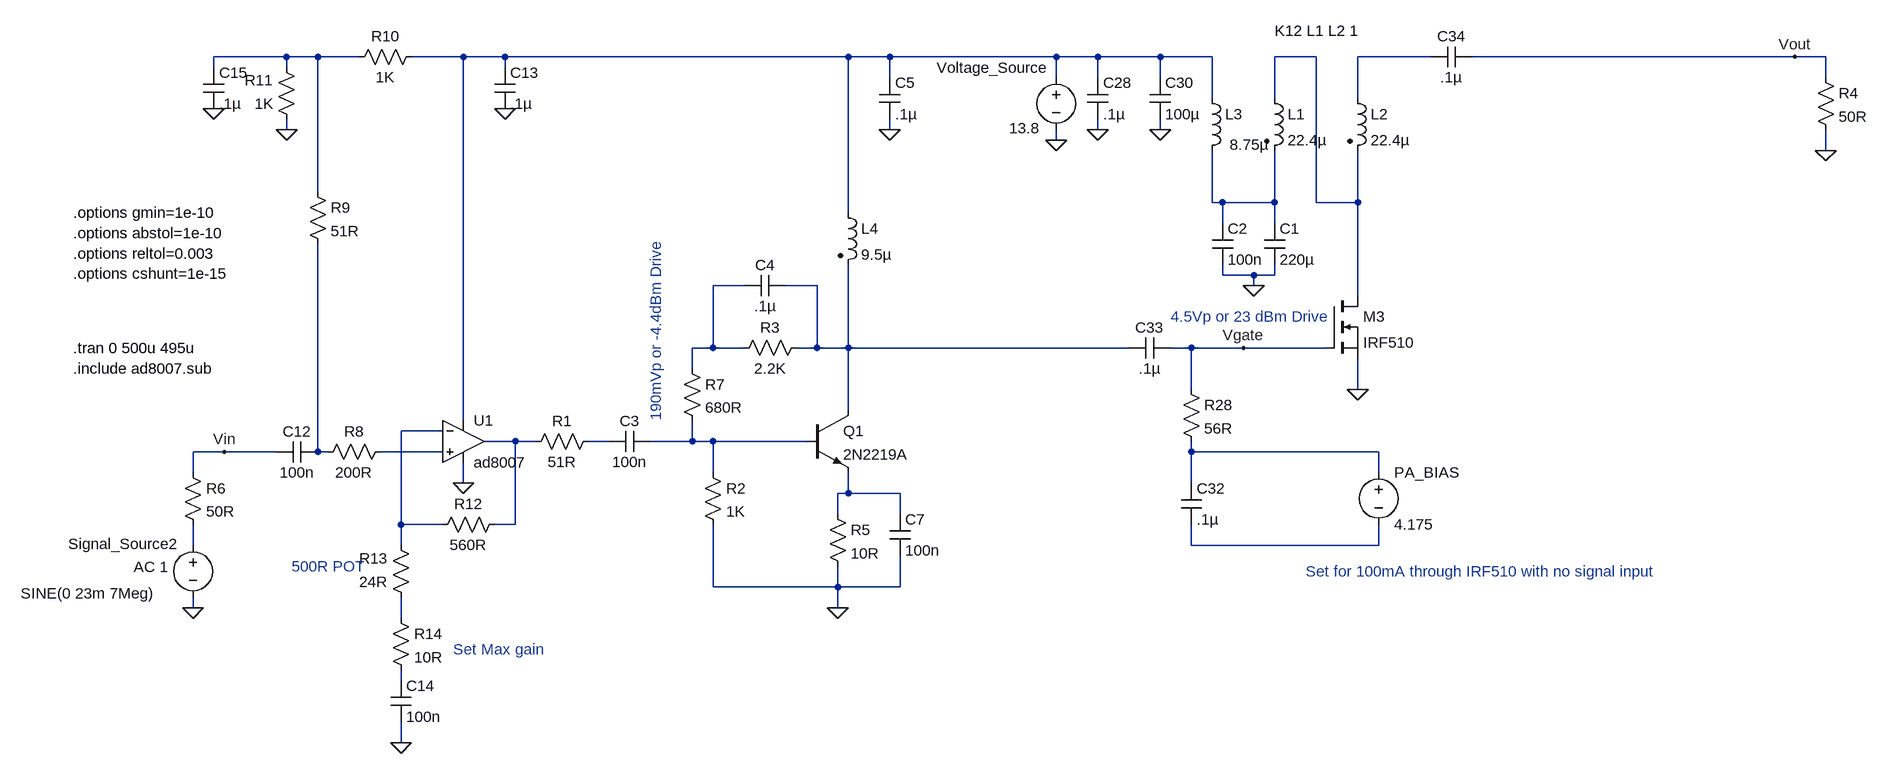
[diagram p0: schematic Power Amp PreDriver+Driver+IRF510 Stage.asc]
Power Amp PreDriver+Driver+IRF510 Stage.asc, the LTspice schematic file:
Version 4
SHEET 1 2716 3076
WIRE -736 1392 -848 1392
WIRE -688 1392 -736 1392
WIRE -624 1392 -688 1392
WIRE -464 1392 -544 1392
WIRE -400 1392 -464 1392
WIRE 128 1392 -400 1392
WIRE 192 1392 128 1392
WIRE 448 1392 192 1392
WIRE 512 1392 448 1392
WIRE 608 1392 512 1392
WIRE 688 1392 608 1392
WIRE 848 1392 784 1392
WIRE 1024 1392 912 1392
WIRE 1584 1392 1088 1392
WIRE 1632 1392 1584 1392
WIRE -848 1408 -848 1392
WIRE -736 1408 -736 1392
WIRE -400 1408 -400 1392
WIRE 192 1424 192 1392
WIRE 448 1424 448 1392
WIRE 512 1424 512 1392
WIRE 608 1424 608 1392
WIRE 1632 1424 1632 1392
WIRE 688 1456 688 1392
WIRE 784 1456 784 1392
WIRE 912 1456 912 1392
WIRE -736 1504 -736 1488
WIRE 192 1504 192 1488
WIRE 512 1504 512 1488
WIRE 608 1504 608 1488
WIRE 448 1520 448 1504
WIRE 1632 1536 1632 1504
WIRE -688 1600 -688 1392
WIRE 688 1616 688 1536
WIRE 704 1616 688 1616
WIRE 784 1616 784 1536
WIRE 784 1616 704 1616
WIRE 848 1616 848 1392
WIRE 912 1616 912 1536
WIRE 912 1616 848 1616
WIRE 128 1632 128 1392
WIRE 704 1648 704 1616
WIRE 784 1648 784 1616
WIRE 704 1728 704 1712
WIRE 752 1728 704 1728
WIRE 784 1728 784 1712
WIRE 784 1728 752 1728
WIRE -32 1744 -80 1744
WIRE 80 1744 32 1744
WIRE 752 1744 752 1728
WIRE 912 1760 912 1616
WIRE -80 1840 -80 1744
WIRE -80 1840 -112 1840
WIRE -32 1840 -80 1840
WIRE 80 1840 80 1744
WIRE 80 1840 48 1840
WIRE 128 1840 128 1712
WIRE 128 1840 80 1840
WIRE 560 1840 128 1840
WIRE 656 1840 624 1840
WIRE 736 1840 656 1840
WIRE 864 1840 736 1840
WIRE -112 1872 -112 1840
WIRE 656 1904 656 1840
WIRE 912 1904 912 1856
WIRE 128 1936 128 1840
WIRE -464 1952 -464 1392
WIRE -496 1968 -560 1968
WIRE -384 1984 -432 1984
WIRE -352 1984 -384 1984
WIRE -240 1984 -272 1984
WIRE -112 1984 -112 1952
WIRE -112 1984 -176 1984
WIRE -80 1984 -112 1984
WIRE 64 1984 -80 1984
WIRE -832 2000 -880 2000
WIRE -752 2000 -832 2000
WIRE -688 2000 -688 1680
WIRE -672 2000 -688 2000
WIRE -496 2000 -592 2000
WIRE 656 2000 656 1984
WIRE 944 2000 656 2000
WIRE -880 2032 -880 2000
WIRE -80 2032 -80 1984
WIRE 944 2032 944 2000
WIRE -464 2048 -464 2016
WIRE 656 2048 656 2000
WIRE 128 2064 128 2032
WIRE 128 2064 112 2064
WIRE 208 2064 128 2064
WIRE 112 2096 112 2064
WIRE 208 2096 208 2064
WIRE -560 2112 -560 1968
WIRE -496 2112 -560 2112
WIRE -384 2112 -384 1984
WIRE -384 2112 -416 2112
WIRE -880 2144 -880 2112
WIRE -560 2144 -560 2112
WIRE 656 2144 656 2112
WIRE 944 2144 944 2112
WIRE 944 2144 656 2144
WIRE -80 2208 -80 2112
WIRE 112 2208 112 2176
WIRE 112 2208 -80 2208
WIRE 208 2208 208 2160
WIRE 208 2208 112 2208
WIRE -880 2240 -880 2224
WIRE 112 2240 112 2208
WIRE -560 2256 -560 2224
WIRE -560 2352 -560 2336
WIRE -560 2448 -560 2416
FLAG 512 1504 0
FLAG 608 1504 0
FLAG 912 1904 0
FLAG 736 1840 Vgate
FLAG 448 1520 0
FLAG 752 1744 0
FLAG 192 1504 0
FLAG 112 2240 0
FLAG 1632 1536 0
FLAG 1584 1392 Vout
FLAG -880 2240 0
FLAG -832 2000 Vin
FLAG -464 2048 0
FLAG -736 1504 0
FLAG -560 2448 0
FLAG -848 1472 0
FLAG -400 1472 0
SYMBOL nmos 864 1760 R0
SYMATTR InstName M3
SYMATTR Value IRF510
SYMBOL voltage 448 1408 R0
WINDOW 123 0 0 Left 2
WINDOW 39 0 0 Left 2
WINDOW 0 -184 1 Left 2
WINDOW 3 -72 94 Left 2
SYMATTR InstName Voltage_Source
SYMATTR Value 13.8
SYMBOL cap 496 1424 R0
SYMATTR InstName C28
SYMATTR Value .1µ
SYMBOL ind2 768 1440 R0
SYMATTR InstName L1
SYMATTR Value 22.4µ
SYMATTR Type ind
SYMBOL ind2 896 1440 R0
SYMATTR InstName L2
SYMATTR Value 22.4µ
SYMATTR Type ind
SYMBOL ind 672 1440 R0
WINDOW 3 43 87 Left 2
SYMATTR Value 8.75µ
SYMATTR InstName L3
SYMBOL cap 592 1424 R0
SYMATTR InstName C30
SYMATTR Value 100µ
SYMBOL res 640 1888 R0
SYMATTR InstName R28
SYMATTR Value 56R
SYMBOL cap 640 2048 R0
SYMATTR InstName C32
SYMATTR Value .1µ
SYMBOL voltage 944 2016 R0
WINDOW 123 0 0 Left 2
WINDOW 39 0 0 Left 2
SYMATTR InstName PA_BIAS
SYMATTR Value 4.175
SYMBOL cap 624 1824 R90
WINDOW 0 0 32 VBottom 2
WINDOW 3 32 32 VTop 2
SYMATTR InstName C33
SYMATTR Value .1µ
SYMBOL cap 1088 1376 R90
WINDOW 0 0 32 VBottom 2
WINDOW 3 32 32 VTop 2
SYMATTR InstName C34
SYMATTR Value .1µ
SYMBOL cap 768 1648 R0
SYMATTR InstName C1
SYMATTR Value 220µ
SYMBOL cap 688 1648 R0
SYMATTR InstName C2
SYMATTR Value 100n
SYMBOL npn 64 1936 R0
SYMATTR InstName Q1
SYMATTR Value 2N2219A
SYMBOL cap -176 1968 R90
WINDOW 0 0 32 VBottom 2
WINDOW 3 32 32 VTop 2
SYMATTR InstName C3
SYMATTR Value 100n
SYMBOL res -96 2016 R0
SYMATTR InstName R2
SYMATTR Value 1K
SYMBOL res 64 1824 R90
WINDOW 0 0 56 VBottom 2
WINDOW 3 32 56 VTop 2
SYMATTR InstName R3
SYMATTR Value 2.2K
SYMBOL cap 32 1728 R90
WINDOW 0 0 32 VBottom 2
WINDOW 3 32 32 VTop 2
SYMATTR InstName C4
SYMATTR Value .1µ
SYMBOL ind2 112 1616 R0
SYMATTR InstName L4
SYMATTR Value 9.5µ
SYMATTR Type ind
SYMBOL res 96 2080 R0
SYMATTR InstName R5
SYMATTR Value 10R
SYMBOL cap 176 1424 R0
SYMATTR InstName C5
SYMATTR Value .1µ
SYMBOL res -128 1856 R0
SYMATTR InstName R7
SYMATTR Value 680R
SYMBOL cap 192 2096 R0
SYMATTR InstName C7
SYMATTR Value 100n
SYMBOL res 1616 1408 R0
SYMATTR InstName R4
SYMATTR Value 50R
SYMBOL voltage -880 2128 R0
WINDOW 3 -265 90 Left 2
WINDOW 123 -91 49 Left 2
WINDOW 0 -192 14 Left 2
WINDOW 39 0 0 Left 2
SYMATTR Value SINE(0 23m 7Meg)
SYMATTR Value2 AC 1
SYMATTR InstName Signal_Source2
SYMBOL res -896 2016 R0
SYMATTR InstName R6
SYMATTR Value 50R
SYMBOL cap -688 1984 R90
WINDOW 0 0 32 VBottom 2
WINDOW 3 32 32 VTop 2
SYMATTR InstName C12
SYMATTR Value 100n
SYMBOL Opamps\\UniversalOpamp2 -464 1984 R0
SYMATTR InstName U1
SYMATTR SpiceModel ""
SYMATTR Value2 ""
SYMATTR SpiceLine ""
SYMATTR SpiceLine2 ""
SYMATTR Value ad8007
SYMBOL res -576 1984 R90
WINDOW 0 0 56 VBottom 2
WINDOW 3 32 56 VTop 2
SYMATTR InstName R8
SYMATTR Value 200R
SYMBOL res -704 1584 R0
SYMATTR InstName R9
SYMATTR Value 51R
SYMBOL res -528 1376 R90
WINDOW 0 0 56 VBottom 2
WINDOW 3 32 56 VTop 2
SYMATTR InstName R10
SYMATTR Value 1K
SYMBOL res -720 1504 R180
WINDOW 0 36 76 Left 2
WINDOW 3 36 40 Left 2
SYMATTR InstName R11
SYMATTR Value 1K
SYMBOL res -400 2096 R90
WINDOW 0 0 56 VBottom 2
WINDOW 3 32 56 VTop 2
SYMATTR InstName R12
SYMATTR Value 560R
SYMBOL res -544 2240 R180
WINDOW 0 36 76 Left 2
WINDOW 3 36 40 Left 2
SYMATTR InstName R13
SYMATTR Value 24R
SYMBOL cap -576 2352 R0
SYMATTR InstName C14
SYMATTR Value 100n
SYMBOL cap -864 1408 R0
SYMATTR InstName C15
SYMATTR Value .1µ
SYMBOL cap -416 1408 R0
SYMATTR InstName C13
SYMATTR Value .1µ
SYMBOL res -256 1968 R90
WINDOW 0 0 56 VBottom 2
WINDOW 3 32 56 VTop 2
SYMATTR InstName R1
SYMATTR Value 51R
SYMBOL res -576 2240 R0
SYMATTR InstName R14
SYMATTR Value 10R
TEXT 784 1352 Left 2 !K12 L1 L2 1
TEXT 832 2184 Left 2 ;Set for 100mA through IRF510 with no signal input
TEXT 624 1792 Left 2 ;4.5Vp or 23 dBm Drive
TEXT -168 1952 VLeft 2 ;190mVp or -4.4dBm Drive
TEXT -1064 1840 Left 2 !.tran 0 500u 495u
TEXT -1064 1872 Left 2 !.include ad8007.sub
TEXT -1064 1632 Left 2 !.options gmin=1e-10\n.options abstol=1e-10\n.options reltol=0.003\n.options cshunt=1e-15
TEXT -728 2176 Left 2 ;500R POT
TEXT -480 2304 Left 2 ;Set Max gain

The netlist it stands for:
* Power Amp PreDriver+Driver+IRF510 Stage.asc
M3 N003 Vgate 0 0 IRF510
Voltage_Source N002 0 13.8
C28 N002 0 .1µ
L1 N003 N005 22.4µ
L2 N004 N003 22.4µ
L3 N002 N005 8.75µ
C30 N002 0 100µ
R28 Vgate N014 56R
C32 N014 N017 .1µ
V§PA_BIAS N014 N017 4.175
C33 Vgate N007 .1µ
C34 Vout N004 .1µ
C1 N005 0 220µ
C2 N005 0 100n
Q1 N007 N011 N015 0 2N2219A
C3 N011 N010 100n
R2 N011 0 1K
R3 N007 N006 2.2K
C4 N007 N006 .1µ
L4 N002 N007 9.5µ
R5 N015 0 10R
C5 N002 0 .1µ
R7 N006 N011 680R
C7 N015 0 100n
R4 Vout 0 50R
V§Signal_Source2 N016 0 SINE(0 23m 7Meg) AC 1
R6 Vin N016 50R
C12 N012 Vin 100n
XU1 N013 N008 N002 0 N009 ad8007  ; pins IN+ IN- V+ V- OUT
R8 N013 N012 200R
R9 N001 N012 51R
R10 N002 N001 1K
R11 0 N001 1K
R12 N009 N008 560R
R13 N018 N008 24R
C14 N019 0 100n
C15 N001 0 .1µ
C13 N002 0 .1µ
R1 N010 N009 51R
R14 N018 N019 10R
.model NPN NPN
.model PNP PNP
.lib standard.bjt
.model NMOS NMOS
.model PMOS PMOS
.lib standard.mos
K12 L1 L2 1
* Set for 100mA through IRF510 with no signal input
* 4.5Vp or 23 dBm Drive
* 190mVp or -4.4dBm Drive
.tran 0 500u 495u
.include ad8007.sub
.options gmin=1e-10
.options abstol=1e-10
.options reltol=0.003
.options cshunt=1e-15
* 500R POT
* Set Max gain
.lib UniversalOpamps2.sub
.backanno
.end